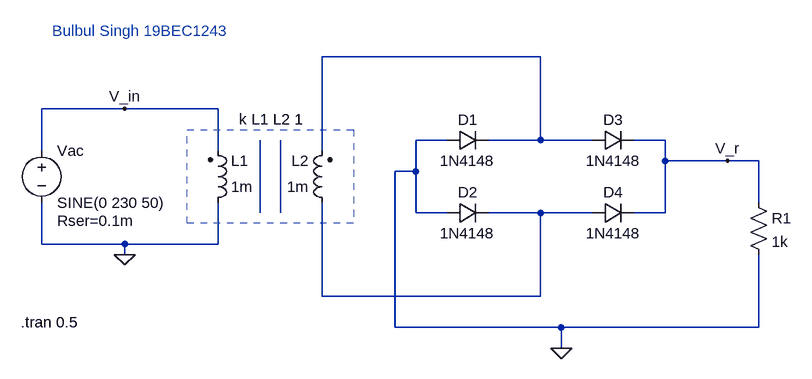
[diagram p0: schematic exp4_task21(1).asc]
exp4_task21(1).asc, the LTspice schematic file:
Version 4
SHEET 1 1048 680
WIRE 656 -16 320 -16
WIRE 16 64 -112 64
WIRE 160 64 16 64
WIRE 512 112 464 112
WIRE 656 112 656 -16
WIRE 656 112 576 112
WIRE 736 112 656 112
WIRE 848 112 800 112
WIRE -112 128 -112 64
WIRE 160 128 160 64
WIRE 320 128 320 -16
WIRE 848 144 848 112
WIRE 944 144 848 144
WIRE 992 144 944 144
WIRE 464 160 464 112
WIRE 464 160 432 160
WIRE 992 208 992 144
WIRE 224 224 224 112
WIRE 256 224 256 112
WIRE 464 224 464 160
WIRE 512 224 464 224
WIRE 656 224 576 224
WIRE 736 224 656 224
WIRE 848 224 848 144
WIRE 848 224 800 224
WIRE -112 272 -112 208
WIRE 16 272 -112 272
WIRE 160 272 160 208
WIRE 160 272 16 272
WIRE 16 288 16 272
WIRE 320 352 320 208
WIRE 656 352 656 224
WIRE 656 352 320 352
WIRE 432 400 432 160
WIRE 688 400 432 400
WIRE 992 400 992 288
WIRE 992 400 688 400
WIRE 688 432 688 400
FLAG 16 64 V_in
FLAG 944 144 V_r
FLAG 16 288 0
FLAG 688 432 0
SYMBOL ind2 144 224 M180
WINDOW 0 36 80 Left 2
WINDOW 3 36 40 Left 2
SYMATTR InstName L1
SYMATTR Value 1m
SYMATTR Type ind
SYMBOL ind2 336 224 R180
WINDOW 0 36 80 Left 2
WINDOW 3 36 40 Left 2
SYMATTR InstName L2
SYMATTR Value 1m
SYMATTR Type ind
SYMBOL voltage -112 112 R0
WINDOW 123 0 0 Left 0
WINDOW 39 24 124 Left 2
SYMATTR SpiceLine Rser=0.1m
SYMATTR InstName Vac
SYMATTR Value SINE(0 230 50)
SYMBOL diode 512 128 R270
WINDOW 0 32 32 VTop 2
WINDOW 3 0 32 VBottom 2
SYMATTR InstName D1
SYMATTR Value 1N4148
SYMBOL diode 512 240 R270
WINDOW 0 32 32 VTop 2
WINDOW 3 0 32 VBottom 2
SYMATTR InstName D2
SYMATTR Value 1N4148
SYMBOL diode 736 128 R270
WINDOW 0 32 32 VTop 2
WINDOW 3 0 32 VBottom 2
SYMATTR InstName D3
SYMATTR Value 1N4148
SYMBOL diode 736 240 R270
WINDOW 0 32 32 VTop 2
WINDOW 3 0 32 VBottom 2
SYMATTR InstName D4
SYMATTR Value 1N4148
SYMBOL res 976 192 R0
SYMATTR InstName R1
SYMATTR Value 1k
TEXT 192 80 Left 2 !k L1 L2 1
TEXT -96 -56 Left 2 ;Bulbul Singh 19BEC1243
TEXT -144 392 Left 2 !.tran 0.5
RECTANGLE Normal 368 240 112 96 2

The netlist it stands for:
* exp4_task21(1).asc
L1 0 V_in 1m
L2 N004 N001 1m
Vac V_in 0 SINE(0 230 50) Rser=0.1m
D1 0 N001 1N4148
D2 0 N004 1N4148
D3 N001 V_r 1N4148
D4 N004 V_r 1N4148
R1 V_r 0 1k
.model D D
.lib standard.dio
k L1 L2 1
* Bulbul Singh 19BEC1243
.tran 0.5
.backanno
.end